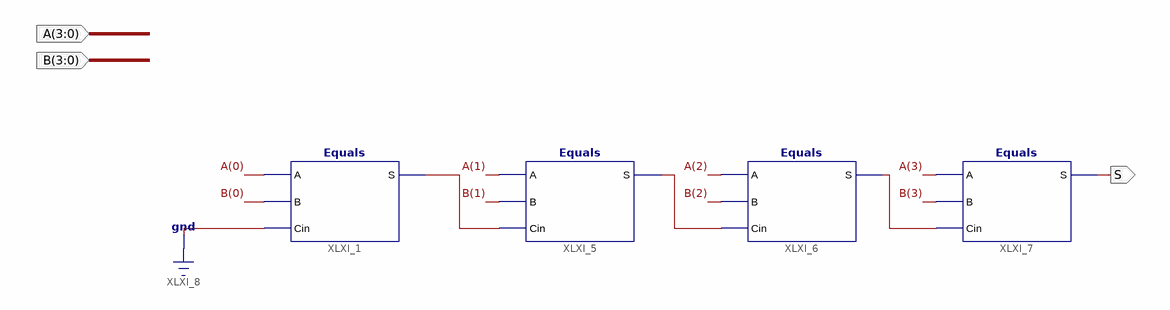
[diagram p0: schematic sheet 1]
// Xilinx ISE schematic EqualsGate.sch (xa9500xl) as structural Verilog: 4 symbols, 3 ports
module EqualsGate (
  input  [3:0] A,
  input  [3:0] B,
  output S
);

  wire XLXN_22, XLXN_23, XLXN_24;

  Equals XLXI_1 (.A(A[0]), .B(B[0]), .Cin(1'b0), .S(XLXN_22));
  Equals XLXI_5 (.A(A[1]), .B(B[1]), .Cin(XLXN_22), .S(XLXN_23));
  Equals XLXI_6 (.A(A[2]), .B(B[2]), .Cin(XLXN_23), .S(XLXN_24));
  Equals XLXI_7 (.A(A[3]), .B(B[3]), .Cin(XLXN_24), .S(S));
endmodule
